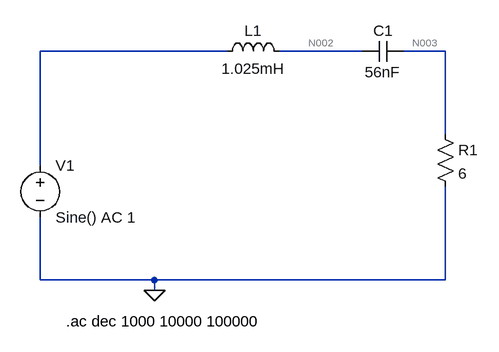
[diagram p0: schematic circuitRLC.asc]
circuitRLC.asc, the LTspice schematic file:
Version 4
SHEET 1 880 680
WIRE 336 -32 48 -32
WIRE 544 -32 416 -32
WIRE 672 -32 608 -32
WIRE 672 96 672 -32
WIRE 48 144 48 -32
WIRE 48 320 48 224
WIRE 224 320 48 320
WIRE 672 320 672 176
WIRE 672 320 224 320
WIRE 224 336 224 320
FLAG 224 336 0
SYMBOL voltage 48 128 R0
SYMATTR InstName V1
SYMATTR Value Sine() AC 1
SYMBOL ind 320 -16 R270
WINDOW 0 32 56 VTop 2
WINDOW 3 5 56 VBottom 2
SYMATTR InstName L1
SYMATTR Value 1.025mH
SYMBOL cap 608 -48 R90
WINDOW 0 0 32 VBottom 2
WINDOW 3 32 32 VTop 2
SYMATTR InstName C1
SYMATTR Value 56nF
SYMBOL res 656 80 R0
SYMATTR InstName R1
SYMATTR Value 6
TEXT 88 384 Left 2 !.ac dec 1000 10000 100000

The netlist it stands for:
* circuitRLC.asc
V1 N001 0 Sine() AC 1
L1 N001 N002 1.025mH
C1 N003 N002 56nF
R1 N003 0 6
.ac dec 1000 10000 100000
.backanno
.end

* Results of the author's LTspice run, read from the files saved beside the schematic
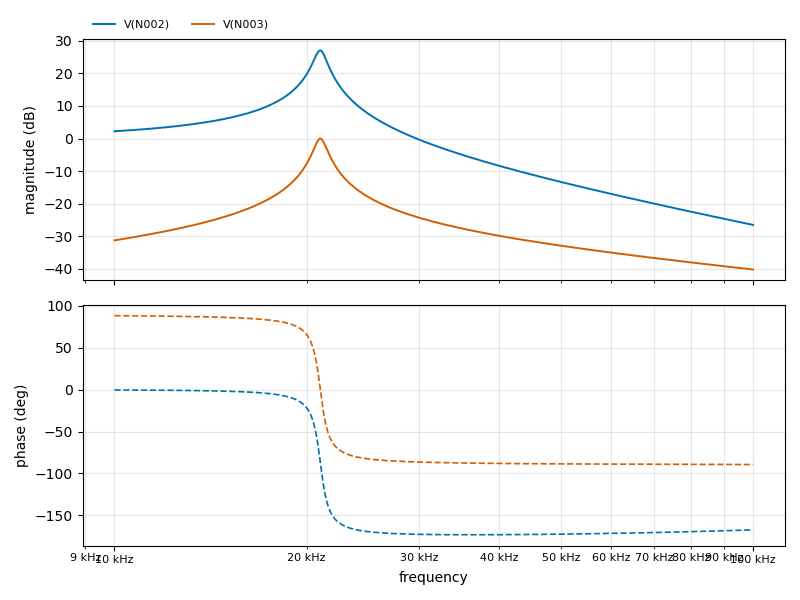
[diagram p1: AC Analysis of circuitRLC.asc, plotted from the saved traces]
* AC Analysis, 1 run:
*   V(N002): 2.23 dB at 10 kHz, -26.52 dB at 100 kHz, peak 27.07 dB at 20.99 kHz, 3 dB below the peak at 20.53 kHz and 21.46 kHz
*   V(N003): -31.28 dB at 10 kHz, -40.22 dB at 100 kHz, peak -0.01 dB at 20.99 kHz, 3 dB below the peak at 20.55 kHz and 21.48 kHz